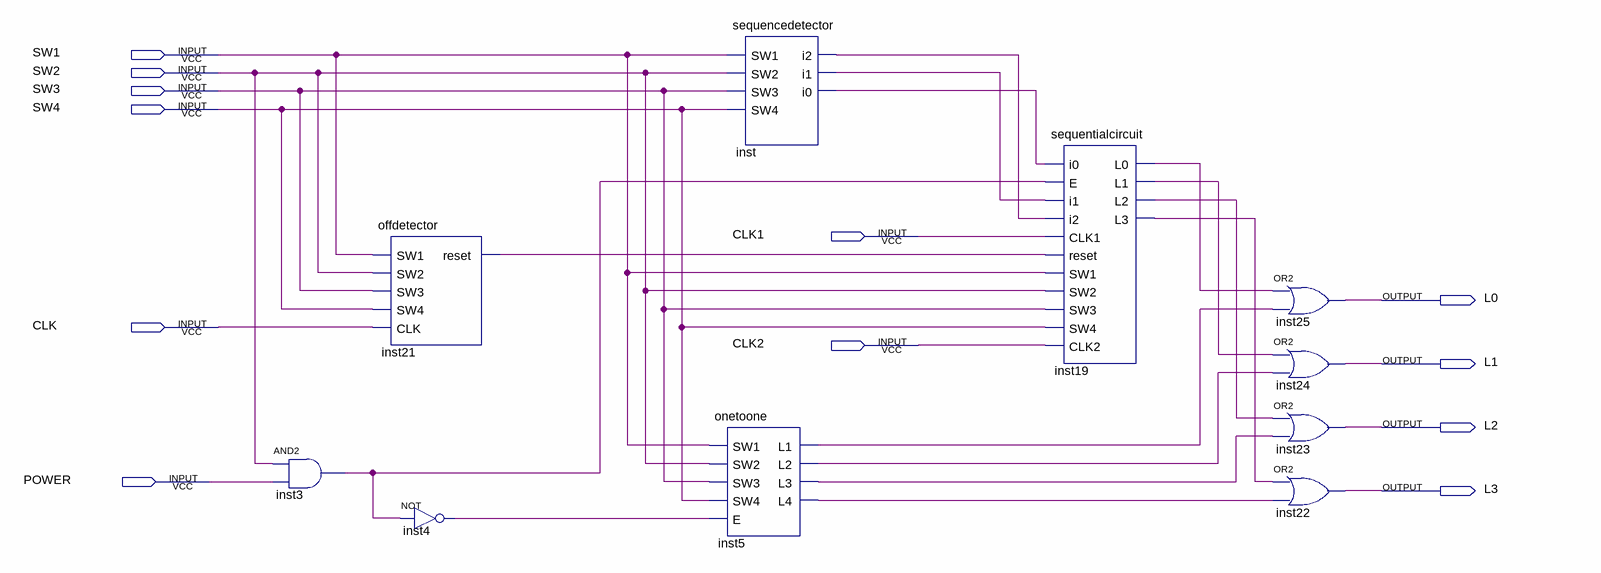
[diagram p0: schematic sheet]
// Quartus schematic newproj.bdf as structural Verilog: 10 symbols, 12 pins
module newproj (
  input  SW1,
  input  SW2,
  input  SW3,
  input  SW4,
  input  CLK1,
  input  CLK,
  input  CLK2,
  input  POWER,
  output L0,
  output L1,
  output L2,
  output L3
);

  wire inst3_out, inst4_out, inst5_l1, inst5_l2, inst5_l3, inst5_l4, inst19_l0, inst19_l1, inst19_l2,
       inst19_l3, inst21_reset, inst_i0, inst_i1, inst_i2;

  and inst3 (inst3_out, SW2, POWER);
  offdetector inst21 (.SW1(SW1), .SW2(SW2), .SW3(SW3), .SW4(SW4), .CLK(CLK), .reset(inst21_reset));
  not inst4 (inst4_out, inst3_out);
  sequencedetector inst (.SW1(SW1), .SW2(SW2), .SW3(SW3), .SW4(SW4), .i2(inst_i2), .i1(inst_i1), .i0(inst_i0));
  onetoone inst5 (
    .SW1(SW1), .SW2(SW2), .SW3(SW3), .SW4(SW4), .E(inst4_out), .L1(inst5_l1), .L2(inst5_l2), .L3(inst5_l3),
    .L4(inst5_l4));
  sequentialcircuit inst19 (
    .i0(inst_i0), .E(inst3_out), .i1(inst_i1), .i2(inst_i2), .CLK1(CLK1), .reset(inst21_reset), .SW1(SW1),
    .SW2(SW2), .SW3(SW3), .SW4(SW4), .CLK2(CLK2), .L0(inst19_l0), .L1(inst19_l1), .L2(inst19_l2),
    .L3(inst19_l3));
  or inst25 (L0, inst19_l0, inst5_l1);
  or inst24 (L1, inst19_l1, inst5_l2);
  or inst23 (L2, inst19_l2, inst5_l3);
  or inst22 (L3, inst19_l3, inst5_l4);
endmodule
